# EAGLE design Eagle6.6 (EAGLE 6.6.0)
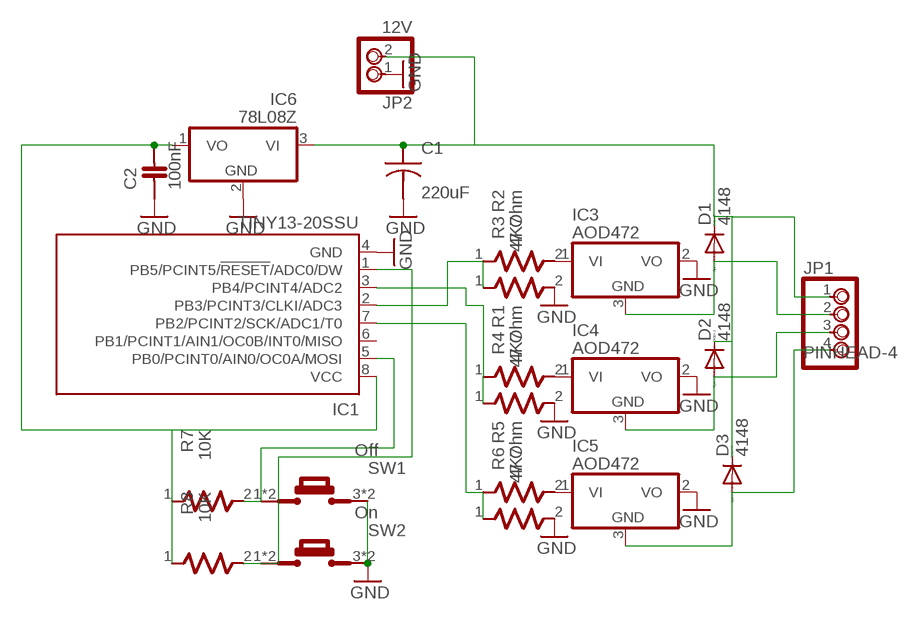
[diagram p0: schematic, sheet 1]

## Parts
C1  220uF  CAP-2,5  [CAP-2,5]
C2  100nF  CAP-NP5  [CAP-NP5]
D1  4148  DIODE-SMB  [SMB]
D2  4148  DIODE-SMB  [SMB]
D3  4148  DIODE-SMB  [SMB]
IC1  TINY13-20SSU  [8S1]
IC3  AOD472  7805DT  [TO252]
IC4  AOD472  7805DT  [TO252]
IC5  AOD472  7805DT  [TO252]
IC6  78L08Z  [TO92]
JP1  PINHEAD-4  [PINHEAD-4]
JP2  12V  PINHEAD-2  [PINHEAD-2]
R1  47 Ohm  R-7,5  [R-7,5]
R2  47 Ohm  R-7,5  [R-7,5]
R3  4K7  R-7,5  [R-7,5]
R4  4K7  R-7,5  [R-7,5]
R5  47 Ohm  R-7,5  [R-7,5]
R6  4K7  R-7,5  [R-7,5]
R7  10K  R-7,5  [R-7,5]
R8  10K  R-7,5  [R-7,5]
SW1  Off  KEY-5  [KEY-5]
SW2  On  KEY-5  [KEY-5]

## Nets
GND: C1.- C2.1 IC1.4(GND) IC3.2(VO) IC4.2(VO) IC5.2(VO) IC6.2(GND) JP2.1 R3.2 R4.2 R6.2 SW1.3 SW1.4 SW2.3 SW2.4
N$1: IC3.1(VI) R2.2
N$2: IC4.1(VI) R1.2
N$3: IC5.1(VI) R5.2
N$4: IC1.7(PB2/PCINT2/SCK/ADC1/T0) R5.1 R6.1
N$5: IC1.3(PB4/PCINT4/ADC2) R1.1 R4.1
N$6: IC1.2(PB3/PCINT3/CLKI/ADC3) R2.1 R3.1
N$7: IC1.5(PB0/PCINT0/AIN0/OC0A/MOSI) R7.2 SW1.1 SW1.2
N$8: D1.A IC3.3(GND) JP1.2
N$9: D2.A IC4.3(GND) JP1.3
N$10: D3.A IC5.3(GND) JP1.4
N$11: C1.+ D1.C D2.C D3.C IC6.3(VI) JP1.1 JP2.2
N$14: IC1.1(PB5/PCINT5/!RESET!/ADC0/DW) R8.2 SW2.1 SW2.2
N$15: C2.2 IC1.8(VCC) IC6.1(VO) R7.1 R8.1
Unconnected: IC1.6(PB1/PCINT1/AIN1/OC0B/INT0/MISO)

## Library data of the parts
C1 = chuong:CAP-2,5
C2 = chuong:CAP-NP5
D1-D3 = diode:DIODE-: DIODE
IC1 = atmel:TINY13: 8-bit AVR Microcontroller with 1K Bytes In-System Programmable Flash Source: http://www.atmel.com/dyn/resources/prod_documents/2535S.pdf; MPN: ATTINY13-20SSU; OC_FARNELL: 1455133; OC_NEWARK: 58M3771
IC3-IC5 = linear:78*: Positive VOLTAGE REGULATOR Source: http://cache.national.com/ds/LM/LM78L05.pdf http://www.fairchildsemi.com/ds/LM/LM7805.pdf
IC6 = chuong:78*: Positive VOLTAGE REGULATOR Source: http://cache.national.com/ds/LM/LM78L05.pdf http://www.fairchildsemi.com/ds/LM/LM7805.pdf
JP1 = chuong:PINHEAD-4
JP2 = chuong:PINHEAD-2
R1-R8 = chuong:R-7,5
SW1 SW2 = chuong:KEY-5

## Board
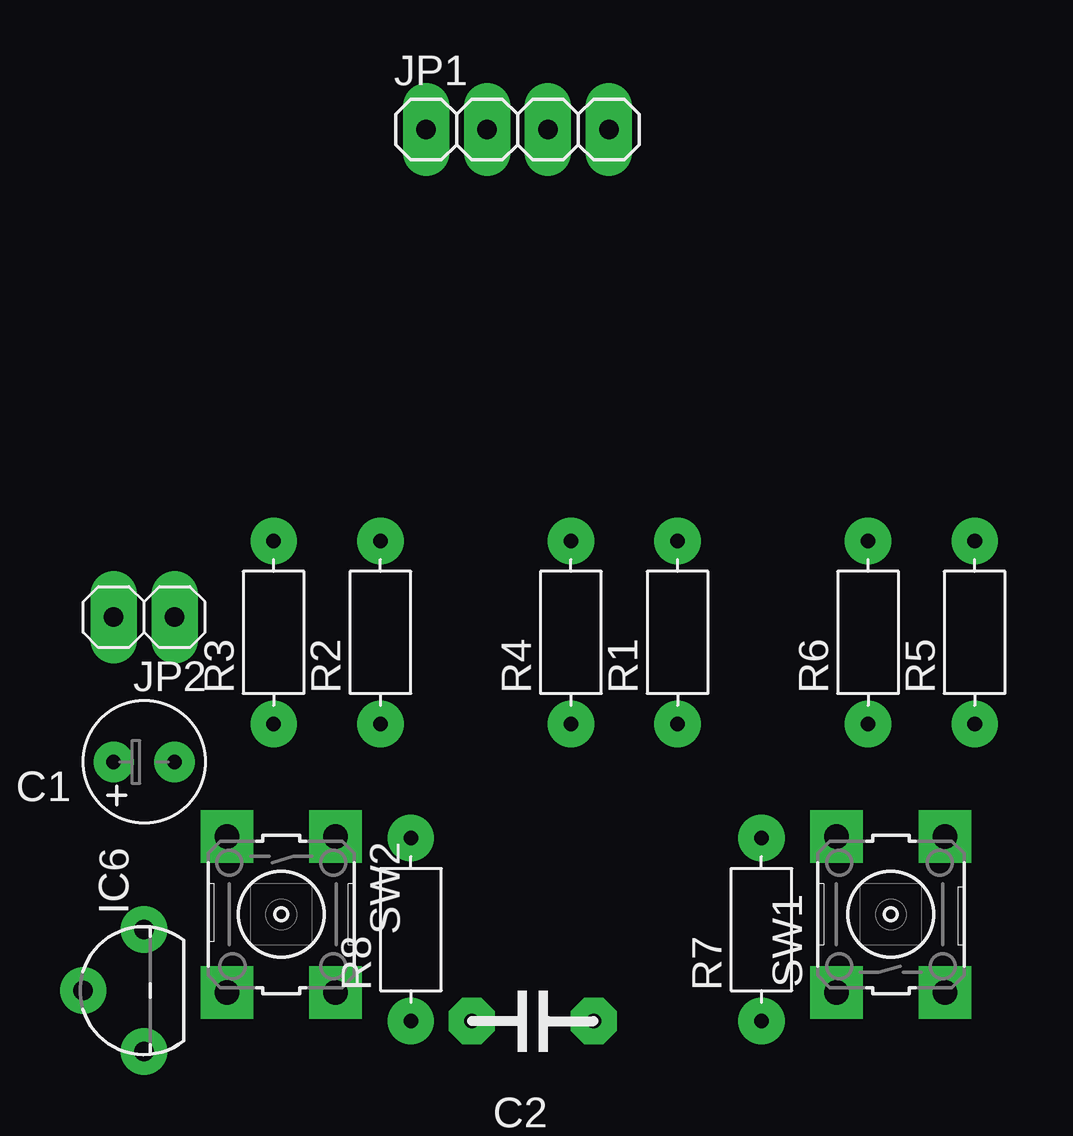
[diagram p1: board, top side]
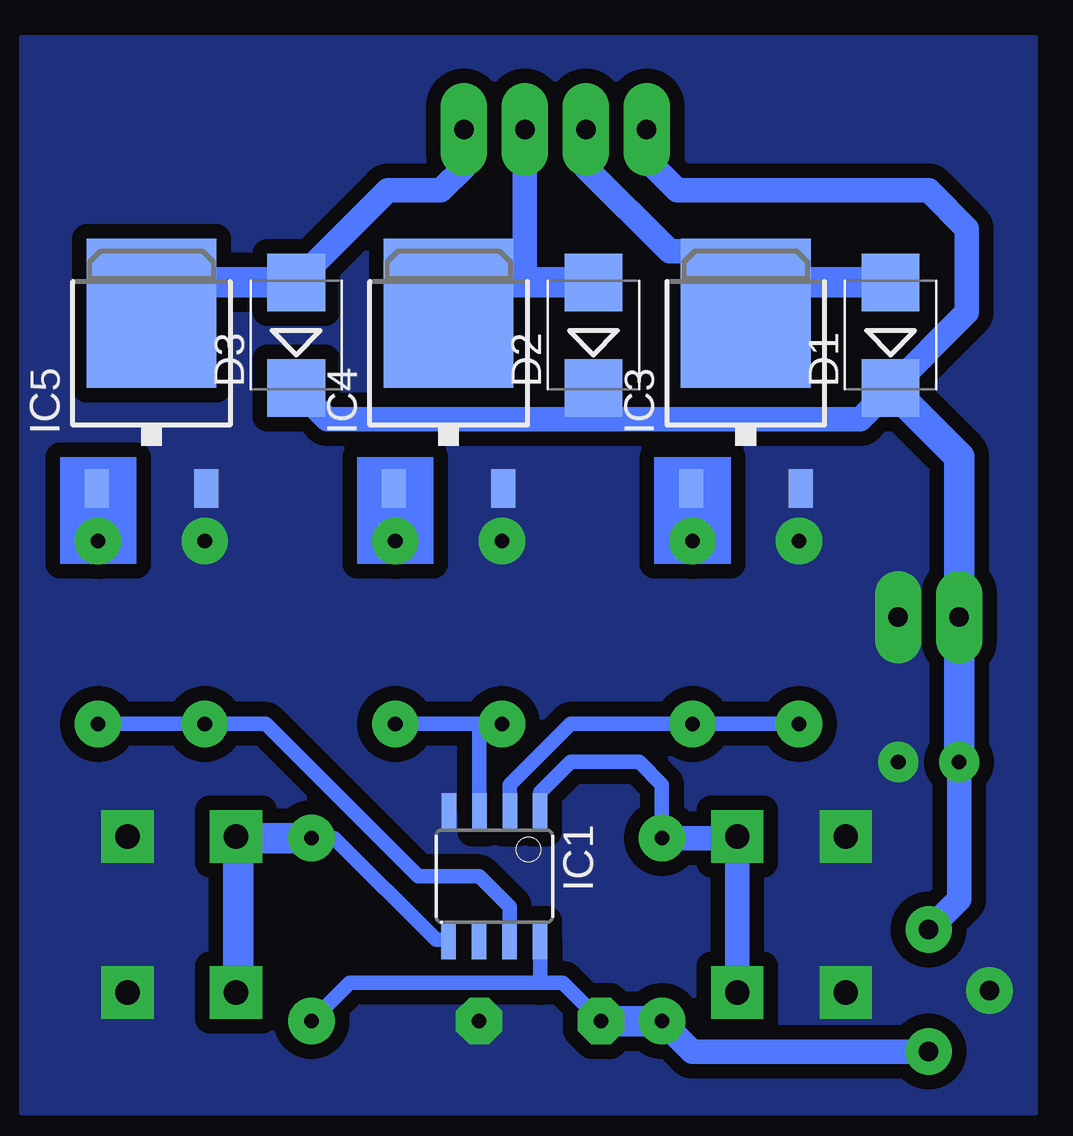
[diagram p2: board, bottom side, seen from below]

No outline drawn. Coordinates in mm, seen from the top.
Copper layers (1*16): Top 0.035mm / dielectric 1.5mm / Bottom 0.035mm
Design rules "default": minimum track width 10mil, minimum drill 24mil, track to track 8mil, track to pad 8mil, pad to pad 8mil, via to via 8mil, smd to smd 8mil, copper to edge 40mil, drill to drill 8mil, minimum pad ring 10mil, minimum via ring 8mil, stop-mask expansion 4mil, vias tented up to drill 0mil, thermal gap 10mil

### Footprints (pad centres in the part's own frame; a part is rotated, then mirrored left to right if it is on the bottom)
CAP-2,5 = drill 0.61 pad 1.676: + 1.27,0; - -1.27,0
CAP-NP5 = drill 0.61 pad 1.93 octagon: 1 -3.81,0; 2 1.27,0
SMB = smd 2.4 x 2.4: A 2.2,0; C -2.2,0
8S1 = smd 0.6 x 1.6: 1 -1.905,-2.654; 2 -0.645,-2.654; 3 0.625,-2.654; 4 1.895,-2.654; 5 1.905,2.654; 6 0.635,2.654; 7 -0.635,2.654; 8 -1.905,2.654
TO252 = smd 1 x 1.6: 1 -2.28,-4.8; 2 2.28,-4.8 | smd 5.4 x 6.2: 3 0,2.5
TO92 = drill 0.813 pad 1.93: 1 -2.54,0; 2 0,2.54; 3 2.54,0
PINHEAD-4 = drill 0.813 pad 1.93 long: 1 -3.81,0; 2 -1.27,0; 3 1.27,0; 4 3.81,0
PINHEAD-2 = drill 0.813 pad 1.93 long: 1 -1.27,0; 2 1.27,0
R-7,5 = drill 0.61 pad 1.93: 1 -3.81,0; 2 3.81,0
KEY-5 = drill 1.016 pad 2.184 square: 1 -3.251,2.261; 2 3.251,2.261; 3 -3.251,-2.261; 4 3.251,-2.261

### Placement (x,y rotation side)
C1  43.5,70.17 180 top
C2  58.42,59.37 180 top
D1  45.09,87.95 90 bottom
D2  57.47,87.95 90 bottom
D3  69.85,87.95 90 bottom
IC1  61.59,65.41 180 bottom
IC3  51.12,86.36 0 bottom
IC4  63.5,86.36 0 bottom
IC5  75.88,86.36 0 bottom
IC6  43.5,60.64 90 top
JP1  59.05,96.52 0 top
JP2  43.5,76.2 180 top
R1  65.72,75.56 90 top
R2  53.34,75.56 90 top
R3  48.9,75.56 90 top
R4  61.28,75.56 90 top
R5  78.11,75.56 90 top
R6  73.66,75.56 90 top
R7  69.22,63.18 90 top
R8  54.61,63.18 90 top
SW1  74.61,63.82 90 top
SW2  49.21,63.82 270 top

### Tracks (layer width: path | path; a pad name or v marks a point on that pad's centre or on a via)
GND
  pour Bottom (isolate 0.61, no thermals): 39.05,100.33 81.28,100.33 81.28,55.56 39.05,55.56
N$1
  Bottom 0.61: IC3.1 53.4,79.43 R2.2
N$2
  Bottom 0.61: IC4.1 65.78,79.43 R1.2
N$3
  Bottom 0.61: IC5.1 78.16,79.43 R5.2
N$4
  Bottom 0.61: R5.1 74.3,71.75 R6.1 71.12,71.75 64.77,65.41 62.23,65.41 60.96,64.14 IC1.7
N$5
  Bottom 0.61: R4.1 62.23,71.75 | 62.23,71.75 R1.1 | IC1.3 62.22,71.75 62.23,71.75
N$6
  Bottom 0.61: R3.1 R2.1 58.42,71.75 60.96,69.22 IC1.2
N$7
  Bottom 0.61: IC1.5 64.02,62.75 68.26,66.99 R7.2
  Bottom 1.27: R7.2 72.28,66.99 | 72.28,66.99 SW1.2 | 72.28,66.99 72.28,60.64 SW1.1
N$8
  Bottom 1.016: 51.12,90.17 52.07,90.17 52.7,90.81 52.7,91.44 54.29,91.44 57.78,94.93 JP1.2
  Bottom 1.27: D1.A 50.78,90.15 50.8,90.17 51.12,90.17 IC3.3
N$9
  Bottom 1.016: JP1.3 60.33,90.15
  Bottom 1.27: D2.A 60.33,90.15 63.16,90.15 63.5,90.49 IC4.3
N$10
  Bottom 1.016: D3.A 69.85,90.17 66.04,93.98 63.82,93.98 62.87,94.93 JP1.4
  Bottom 1.27: D3.A 75.86,90.15 75.88,90.17 IC5.3
N$11
  Bottom 1.016: 57.47,84.45 46.35,84.45 45.09,85.72 D1.C 45.06,85.75 41.91,88.9 41.91,92.39 43.5,93.98 53.98,93.98 55.24,95.25 JP1.1 | 57.47,84.45 68.56,84.45 D3.C | D2.C 57.47,84.45 | C1.+ 42.23,64.45 IC6.3
  Bottom 1.27: C1.+ JP2.2 42.23,82.89 D1.C
N$14
  Bottom 0.61: IC1.1 59.69,68.9 58.42,70.17 55.56,70.17 54.61,69.22 R8.2
  Bottom 1.016: SW2.2 SW2.1 51.55,66.99 R8.2
N$15
  Bottom 0.61: 59.69,60.96 58.74,60.96 C2.2 | 59.69,60.96 67.63,60.96 R7.1 | IC1.8 59.69,60.96
  Bottom 1.016: IC6.1 53.34,58.1 R8.1
  Bottom 1.27: R8.1 C2.2
(copper drawn outside any net)
  shapes: Bottom area x3